# EAGLE design strip2 (EAGLE 6.6.0)
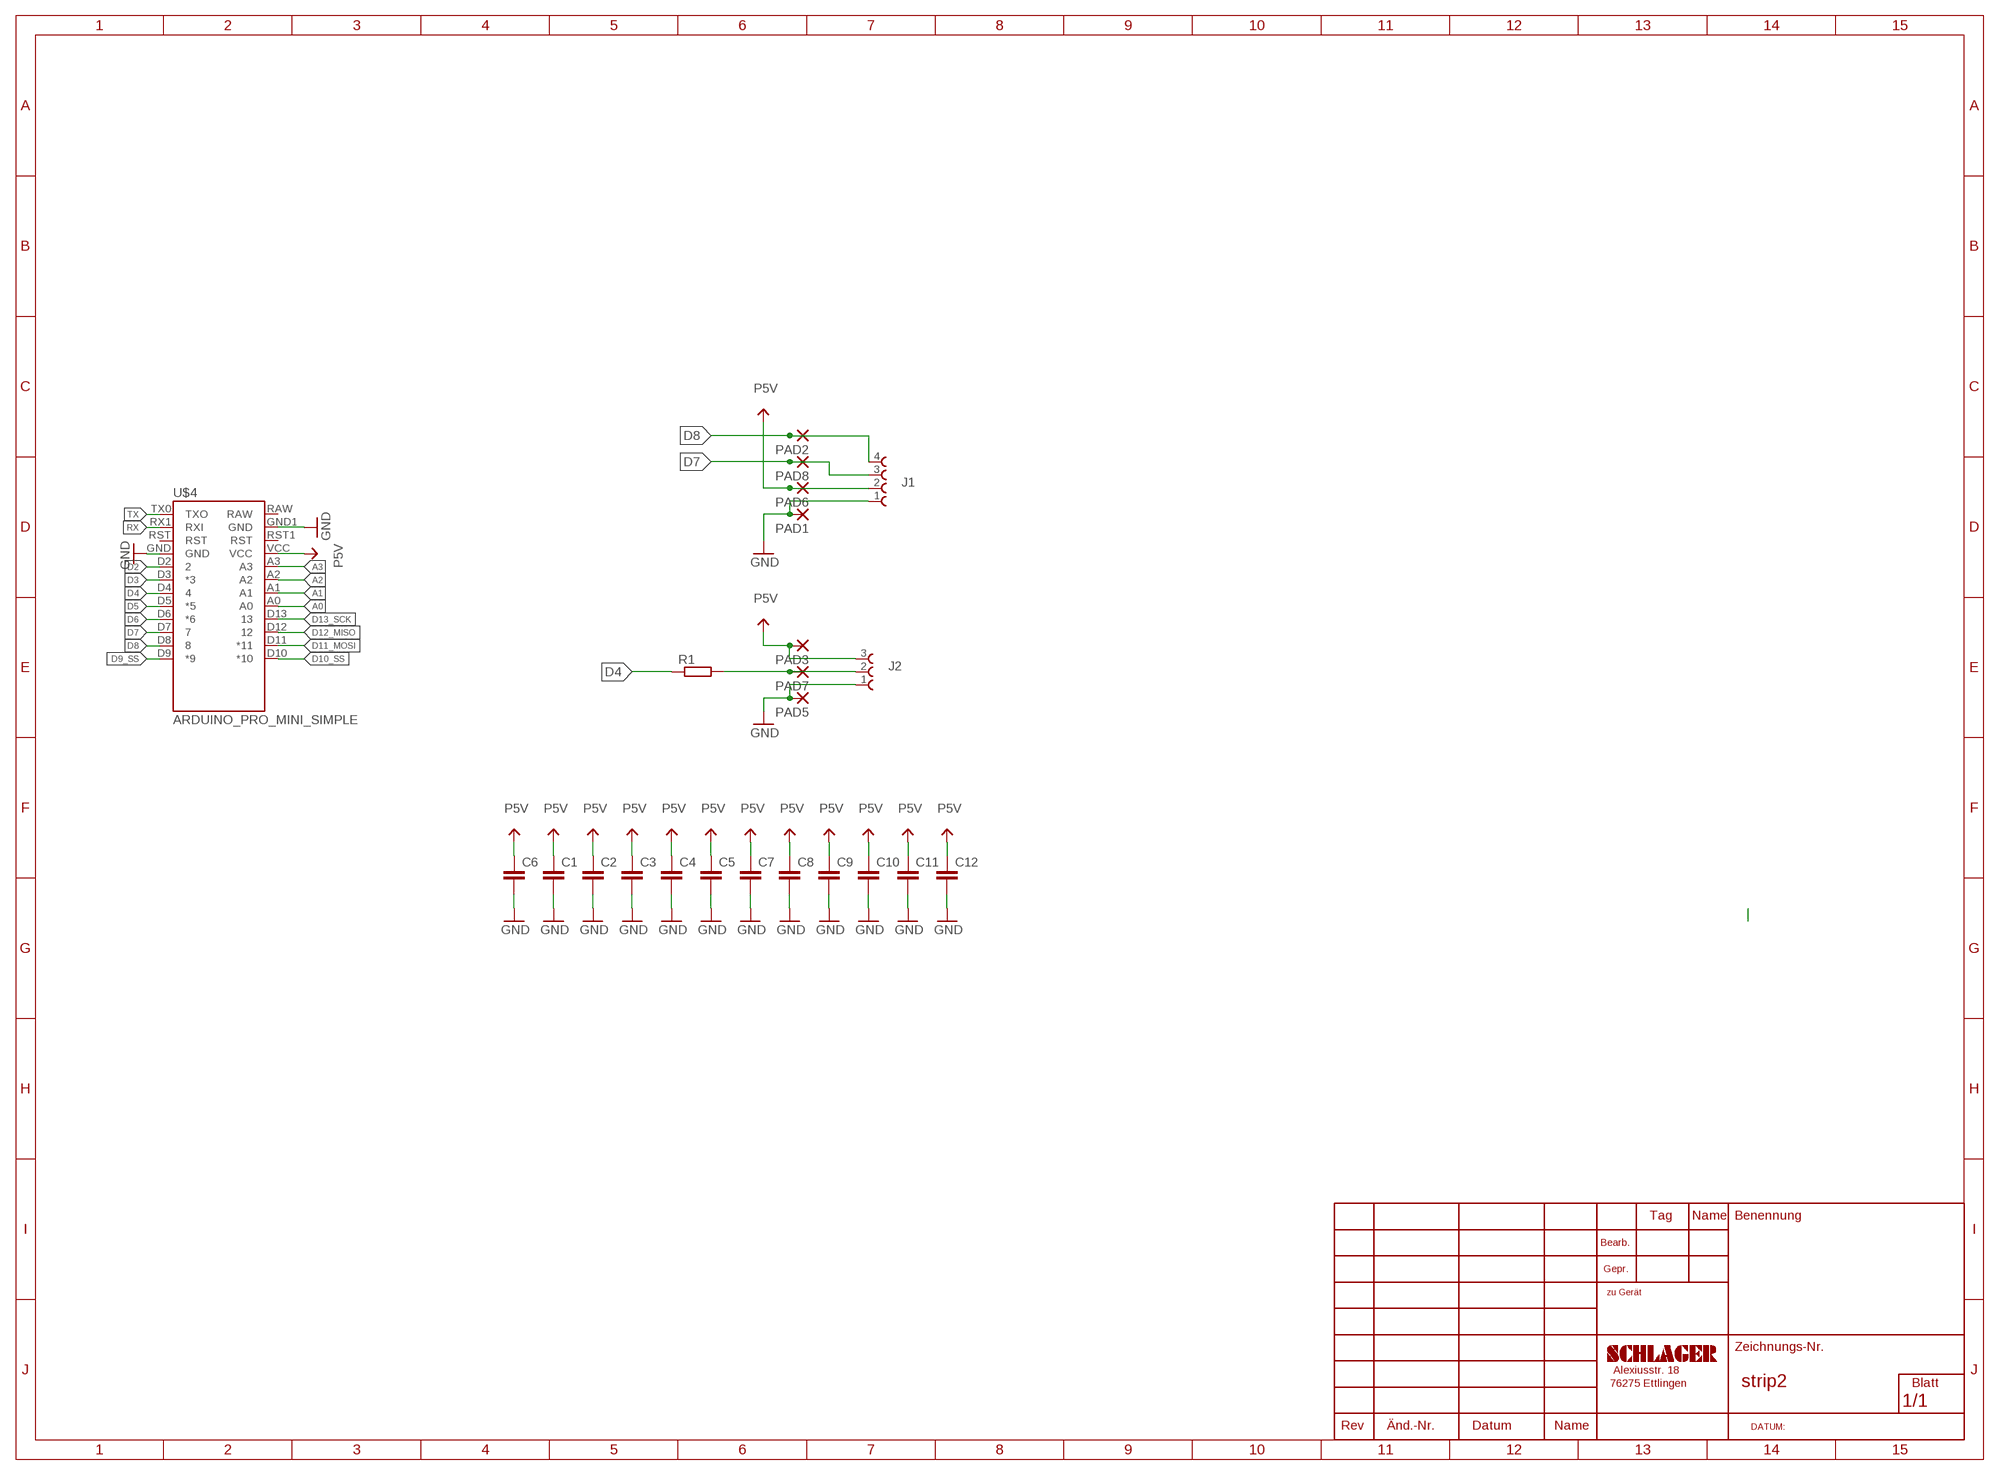
[diagram p0: schematic, sheet 1]

## Parts
C1  C-EUC1210K  [C1210K]
C2  C-EUC1210K  [C1210K]
C3  C-EUC1210K  [C1210K]
C4  C-EUC1210K  [C1210K]
C5  C-EUC1210K  [C1210K]
C6  C-EUC1210K  [C1210K]
C7  C-EUC1206K  [C1206K]
C8  C-EUC1206K  [C1206K]
C9  C-EUC1206K  [C1206K]
C10  C-EUC1206K  [C1206K]
C11  C-EUC1206K  [C1206K]
C12  C-EUC1206K  [C1206K]
J1  691322110004  [691322110004]
J2  691322110003  [691322110003]
PAD1  SMD2  [SMD1,27-2,54]
PAD2  SMD2  [SMD1,27-2,54]
PAD3  SMD2  [SMD1,27-2,54]
PAD5  SMD2  [SMD1,27-2,54]
PAD6  SMD2  [SMD1,27-2,54]
PAD7  SMD2  [SMD1,27-2,54]
PAD8  SMD2  [SMD1,27-2,54]
R1  R-EU_R0805  [R0805]
U$4  ARDUINO_PRO_MINI_SIMPLE  [PRO_MINI_SIMPLE]

## Nets
A0: U$4.A0
A1: U$4.A1
A2: U$4.A2
A3: U$4.A3
D2: U$4.D2
D3: U$4.D3(*3)
D4: R1.1 U$4.D4
D5: U$4.D5(*5)
D6: U$4.D6(*6)
D7: J1.3 PAD8.1(P) U$4.D7
D8: J1.4 PAD2.1(P) U$4.D8
D9_SS: U$4.D9(*9)
D10_SS: U$4.D10(*10)
D11_MOSI: U$4.D11(*11)
D12_MISO: U$4.D12
D13_SCK: U$4.D13
GND: C1.2 C2.2 C3.2 C4.2 C5.2 C6.2 C7.2 C8.2 C9.2 C10.2 C11.2 C12.2 J1.1 J2.1 PAD1.1(P) PAD5.1(P) U$4.GND U$4.GND1(GND)
N$1: J2.2 PAD7.1(P) R1.2
P5V: C1.1 C2.1 C3.1 C4.1 C5.1 C6.1 C7.1 C8.1 C9.1 C10.1 C11.1 C12.1 J1.2 J2.3 PAD3.1(P) PAD6.1(P) U$4.VCC
RX: U$4.RX1(RXI)
TX: U$4.TX0(TXO)
Unconnected: U$4.RAW U$4.RST U$4.RST1(RST)

## Library data of the parts
C1-C12 = debauer_passiv:C-EU: CAPACITOR, European symbol
J1 = Wuerth_TERMINAL_BLOCKS-rev16e:691322110004: WR-TBL Serie 3221 - 3.50mm Horizontal PCB Header, 4 Pins=>Code : Con_TBL_Pluggable_3.50_PCB_H_691322110004 <http://katalog.we-online.de/media/images/eican/Con_TBL_Pluggable_3.50_PCB_H_6913221100xx_pf2.jpg> Details see: http://katalog.we-online.de/en/em/TBL_3_50_3221_HORIZONTAL_PCB_HEADER_69132211000X Created 2014-06-18, Karrer Zheng 2014 (C) Würth Elektronik
J2 = Wuerth_TERMINAL_BLOCKS-rev16e:691322110003: WR-TBL Serie 3221 - 3.50mm Horizontal PCB Header, 3 Pins=>Code : Con_TBL_Pluggable_3.50_PCB_H_691322110003 <http://katalog.we-online.de/media/images/eican/Con_TBL_Pluggable_3.50_PCB_H_6913221100xx_pf2.jpg> Details see: http://katalog.we-online.de/en/em/TBL_3_50_3221_HORIZONTAL_PCB_HEADER_69132211000X Created 2014-06-18, Karrer Zheng 2014 (C) Würth Elektronik
PAD1-PAD3 PAD5-PAD8 = wirepad:SMD2: SMD PAD
R1 = debauer_passiv:R-EU_: RESISTOR, European symbol
U$4 = debauer_modules:ARDUINO_PRO_MINI_SIMPLE

## Net classes
0 default: width 0.203 mm, drill 0.203 mm, clearance 0.178 mm
4 USBpair: width 0.254 mm, drill 0.406 mm, clearance 0.508 mm

## Board
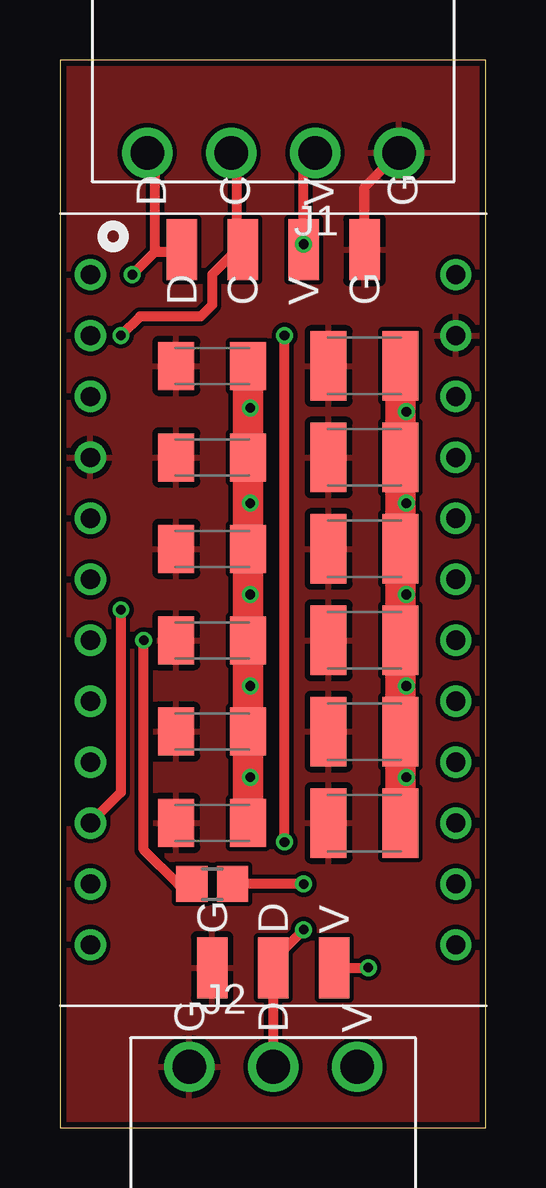
[diagram p1: board, top side]
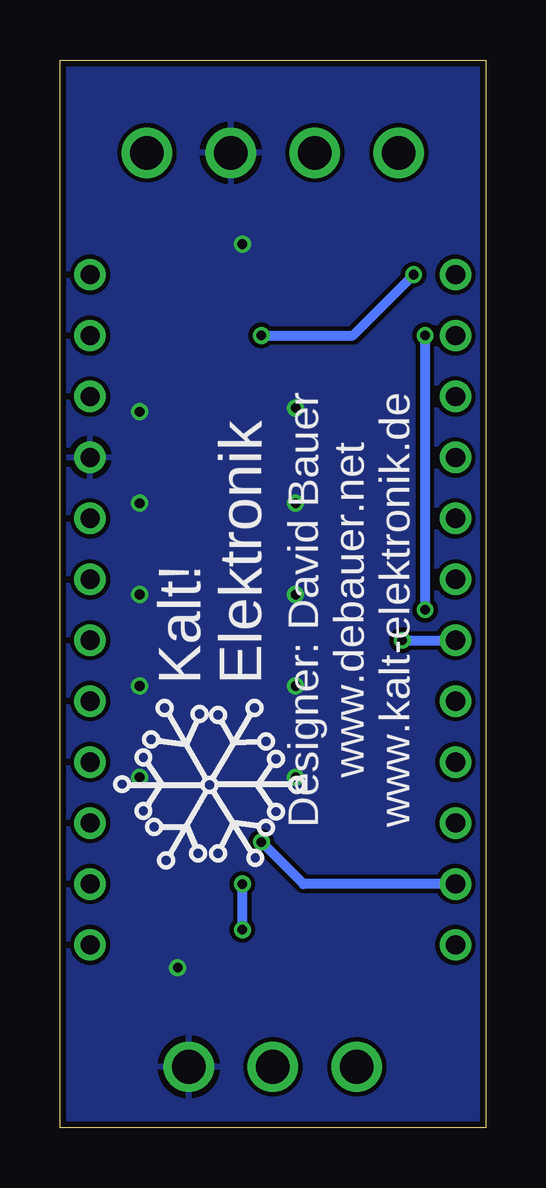
[diagram p2: board, bottom side, seen from below]

Size 17.77 x 44.51 mm. Coordinates in mm from the lower left corner, seen from the top.
Outline: 0,0 17.77,0 17.77,44.51 0,44.51 0,0
Copper layers (1*16): Top 0.035mm / dielectric 1.5mm / Bottom 0.035mm
Design rules "ITEADstudio_DRC": minimum track width 6mil, minimum drill 12mil, track to track 6mil, track to pad 6mil, pad to pad 6mil, via to via 6mil, smd to smd 0mil, copper to edge 10mil, drill to drill 10mil, minimum pad ring 10mil, minimum via ring 6mil, stop-mask expansion 2mil, vias tented up to drill 100mil, thermal gap 10mil

### Footprints (pad centres in the part's own frame; a part is rotated, then mirrored left to right if it is on the bottom)
C1210K = smd 1.5 x 2.9: 1 -1.5,0; 2 1.5,0
C1206K = smd 1.5 x 2: 1 -1.5,0; 2 1.5,0
691322110004 = drill 1.4: 1 -5.25,0; 2 -1.75,0; 3 1.75,0; 4 5.25,0
691322110003 = drill 1.4: 1 -3.5,0; 2 0,0; 3 3.5,0
SMD1,27-2,54 = smd 1.27 x 2.54: 1 0,0
R0805 = smd 1.3 x 1.5: 1 -0.85,0; 2 0.85,0
PRO_MINI_SIMPLE = drill 0.8: A0 7.62,3.81; A1 7.62,1.27; A2 7.62,-1.27; A3 7.62,-3.81; D2 -7.62,3.81; D3 -7.62,1.27; D4 -7.62,-1.27; D5 -7.62,-3.81; D6 -7.62,-6.35; D7 -7.62,-8.89; D8 -7.62,-11.43; D9 -7.62,-13.97; D10 7.62,-13.97; D11 7.62,-11.43; D12 7.62,-8.89; D13 7.62,-6.35; GND 7.62,11.43; GND1 -7.62,6.35; RAW 7.62,13.97; RST 7.62,8.89; RST1 -7.62,8.89; RX1 -7.62,11.43; TX0 -7.62,13.97; VCC 7.62,6.35

### Placement (x,y rotation side)
C1  12.7,24.13 180 top
C2  12.7,20.32 180 top
C3  12.7,16.51 180 top
C4  12.7,12.7 180 top
C5  12.7,27.94 180 top
C6  12.7,31.75 180 top
C7  6.35,12.7 180 top
C8  6.35,16.51 180 top
C9  6.35,20.32 180 top
C10  6.35,24.13 180 top
C11  6.35,27.94 180 top
C12  6.35,31.75 180 top
J1  8.89,40.64 180 top
J2  8.89,2.54 0 top
PAD1  12.7,36.59 0 top
PAD2  5.08,36.59 0 top
PAD3  11.43,6.67 0 top
PAD5  6.35,6.67 0 top
PAD6  10.16,36.59 0 top
PAD7  8.89,6.67 0 top
PAD8  7.62,36.59 0 top
R1  6.35,10.16 0 top
U$1  [KALT!ELEKTRONIK]  11.43,21.59 90 bottom
U$4  8.89,21.59 0 top

### Tracks (layer width: path | path; a pad name or v marks a point on that pad's centre or on a via)
D4  (via drill 0.4)
  Top 0.406: R1.1 4.92,10.16 3.49,11.59 v3.49,20.32
  Bottom 0.406: v3.49,20.32 U$4.D4
D7  (via drill 0.4)
  Top 0.406: PAD8.1 7.38,36.59 | 7.38,36.59 6.35,35.56 6.35,34.29 5.87,33.81 3.33,33.81 v2.54,33.02 | v2.54,21.59 2.54,13.97 U$4.D7 | 7.38,36.59 7.38,40.4 J1.3
  Bottom 0.406: v2.54,33.02 v2.54,21.59
D8  (via drill 0.4)
  Top 0.406: v9.37,11.91 v9.37,33.02 | v3.02,35.56 3.97,36.51 | 3.97,36.51 5,36.51 PAD2.1 | 3.97,36.51 3.97,40.31 J1.4
  Bottom 0.406: U$4.D8 7.62,10.16 v9.37,11.91 | v9.37,33.02 5.56,33.02 v3.02,35.56
GND
  Top 0.406: PAD1.1 12.7,39.2 J1.1
  pour Top: 0,44.45 17.78,44.45 17.78,0 0,0
N$1  (via drill 0.4)
  Top 0.406: v10.16,8.26 8.89,6.99 PAD7.1 J2.2 | v10.16,10.16 R1.2
  Bottom 0.406: v10.16,8.26 v10.16,10.16
P5V  (via drill 0.4)
  Top 0.406: PAD3.1 v12.86,6.67 12.84,6.68 | PAD6.1 v10.16,36.83 10.16,40.16 J1.2
  Top 0.61: v14.45,14.61 14.45,16.26 C3.1 | C12.1 7.85,30.09 v7.94,30
  Top 1.27: C7.1 C8.1 C9.1 C10.1 C11.1 C12.1 | C6.1 C5.1 C1.1 C2.1 C3.1 C4.1
  other vias: 7.94,14.61 7.94,18.41 7.94,22.23 7.94,26.04 14.45,29.84 14.45,26.04 14.45,22.23 14.45,18.41
  pour Bottom: 0,44.45 17.78,44.45 17.78,0 0,0

### Text on the board
tPlace: D | C | V | G | D | C | V | G | G | D | V | G | D | V
bPlace: www.kalt-elektronik.de | www.debauer.net | Designer: David Bauer